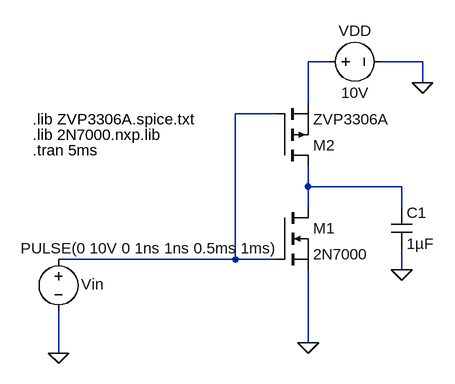
[diagram p0: schematic prelab3_task1.asc]
prelab3_task1.asc, the LTspice schematic file:
Version 4.1
SHEET 1 1140 680
WIRE 560 -192 528 -192
WIRE 704 -192 640 -192
WIRE 704 -160 704 -192
WIRE 528 -128 528 -192
WIRE 480 -112 416 -112
WIRE 528 0 528 -32
WIRE 672 0 528 0
WIRE 528 32 528 0
WIRE 672 32 672 0
WIRE 416 112 416 -112
WIRE 416 112 144 112
WIRE 480 112 416 112
WIRE 672 128 672 96
WIRE 528 240 528 128
WIRE 144 256 144 192
FLAG 144 256 0
FLAG 528 240 0
FLAG 704 -160 0
FLAG 672 128 0
SYMBOL voltage 144 96 R0
WINDOW 0 35 54 Left 2
WINDOW 3 -58 -1 Left 2
WINDOW 123 0 0 Left 0
WINDOW 39 0 0 Left 0
SYMATTR InstName Vin
SYMATTR Value PULSE(0 10V 0 1ns 1ns 0.5ms 1ms)
SYMBOL nmos 480 32 R0
SYMATTR InstName M1
SYMATTR Value 2N7000
SYMATTR Prefix X
SYMATTR SpiceModel 2N7000
SYMBOL pmos 480 -32 M180
SYMATTR InstName M2
SYMATTR Value ZVP3306A
SYMATTR Prefix X
SYMATTR SpiceModel ZVP3306A
SYMBOL voltage 544 -192 R270
WINDOW 0 32 56 VTop 2
WINDOW 3 -32 56 VBottom 2
SYMATTR InstName VDD
SYMATTR Value 10V
SYMBOL cap 656 32 R0
SYMATTR InstName C1
SYMATTR Value 1µF
TEXT 104 -80 Left 2 !.lib 2N7000.nxp.lib
TEXT 104 -104 Left 2 !.lib ZVP3306A.spice.txt
TEXT 104 -56 Left 2 !.tran 5ms

The netlist it stands for:
* prelab3_task1.asc
Vin N002 0 PULSE(0 10V 0 1ns 1ns 0.5ms 1ms)
X§M1 N003 N002 0 2N7000 2N7000  ; pins D G S
X§M2 N003 N002 N001 ZVP3306A ZVP3306A  ; pins D G S
VDD N001 0 10V
C1 N003 0 1µF
.lib 2N7000.nxp.lib
.lib ZVP3306A.spice.txt
.tran 5ms
.backanno
.end